# Altium project TP2.PrjPcb
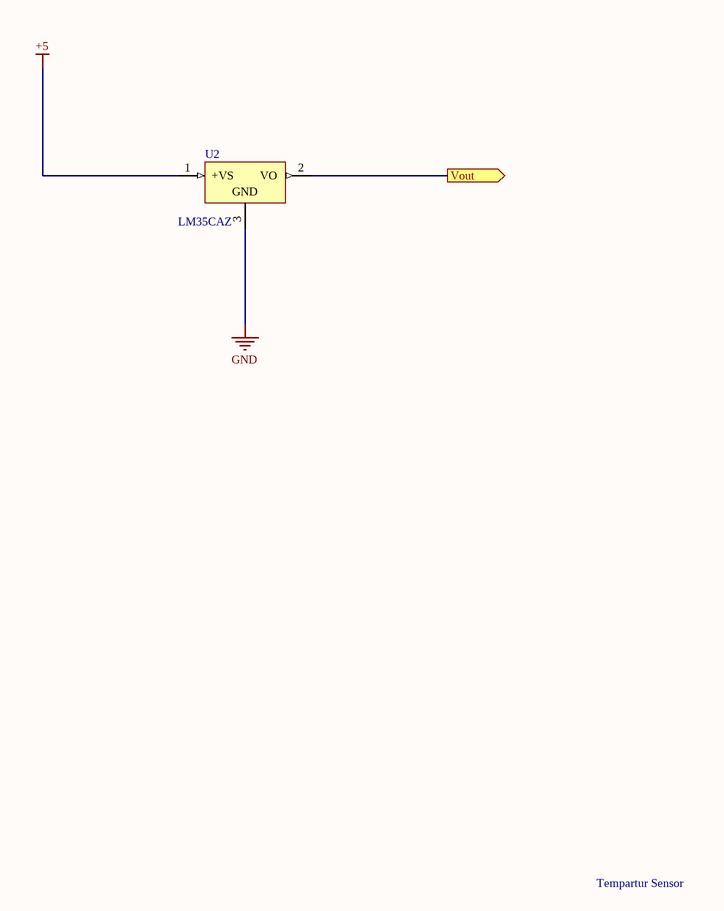
[diagram p0: Sensor.SchDoc]
1 sheet, 1 parts. Net scope: flat (ports and power ports of the same name join across sheets).

## Sheet Sensor.SchDoc
size Letter; SheetNumber: 3; SheetTotal: 3

### Parts
U2  LM35CAZ  [Z03A]

### Ports
Vout (out)

### Nets
+5: U2.1(+VS)
GND: U2.3(GND)
NetU2_2: U2.2(VO) ; port Vout

### Notes on the sheet
- Tempartur Sensor

### Library data of the parts
U2 = LM35CAZ: Precision Centigrade Temperature Sensor, 3-pin TO-92; Manufacturer: National Semiconductor; PackageTopMarking: NSXYTT*LM35*CAZ; PowerWise: N; CompType: Temp Sensor IC; Published: 4-Dec-2008; LatestRevisionDate: 15-Jul-2009; LatestRevisionNote: Sch pins 1 & 3 reversed.; DatasheetVersion: Nov-2000; PackageVersion: revG, Sep-2000; PackageReference: Z03A; Publisher: Altium Limited; PackageDescription: TO-92, Molded, 3 Lead; Supplier 1: Farnell; Supplier Part Number 1: 9494529; PartNumber: LM35CAZ; RoHS: N; PinCount: 3; Code_JEDEC: TO-226-AA; ComponentLink1Description: LM35 Datasheet; ComponentLink1URL: http://www.national.com/ds/LM/LM35.pdf; ComponentLink2Description: LM35 Web Page; ComponentLink2URL: http://www.national.com/pf/LM/LM35.html; ComponentLink3Description: Z03A Package Page; ComponentLink3URL: http://www.national.com/packaging/folders/z03a.html